# Altium schematic sheet [02] - MCU.SchDoc
size A2; DocumentNumber: 2; SheetNumber: 2; SheetTotal: 14
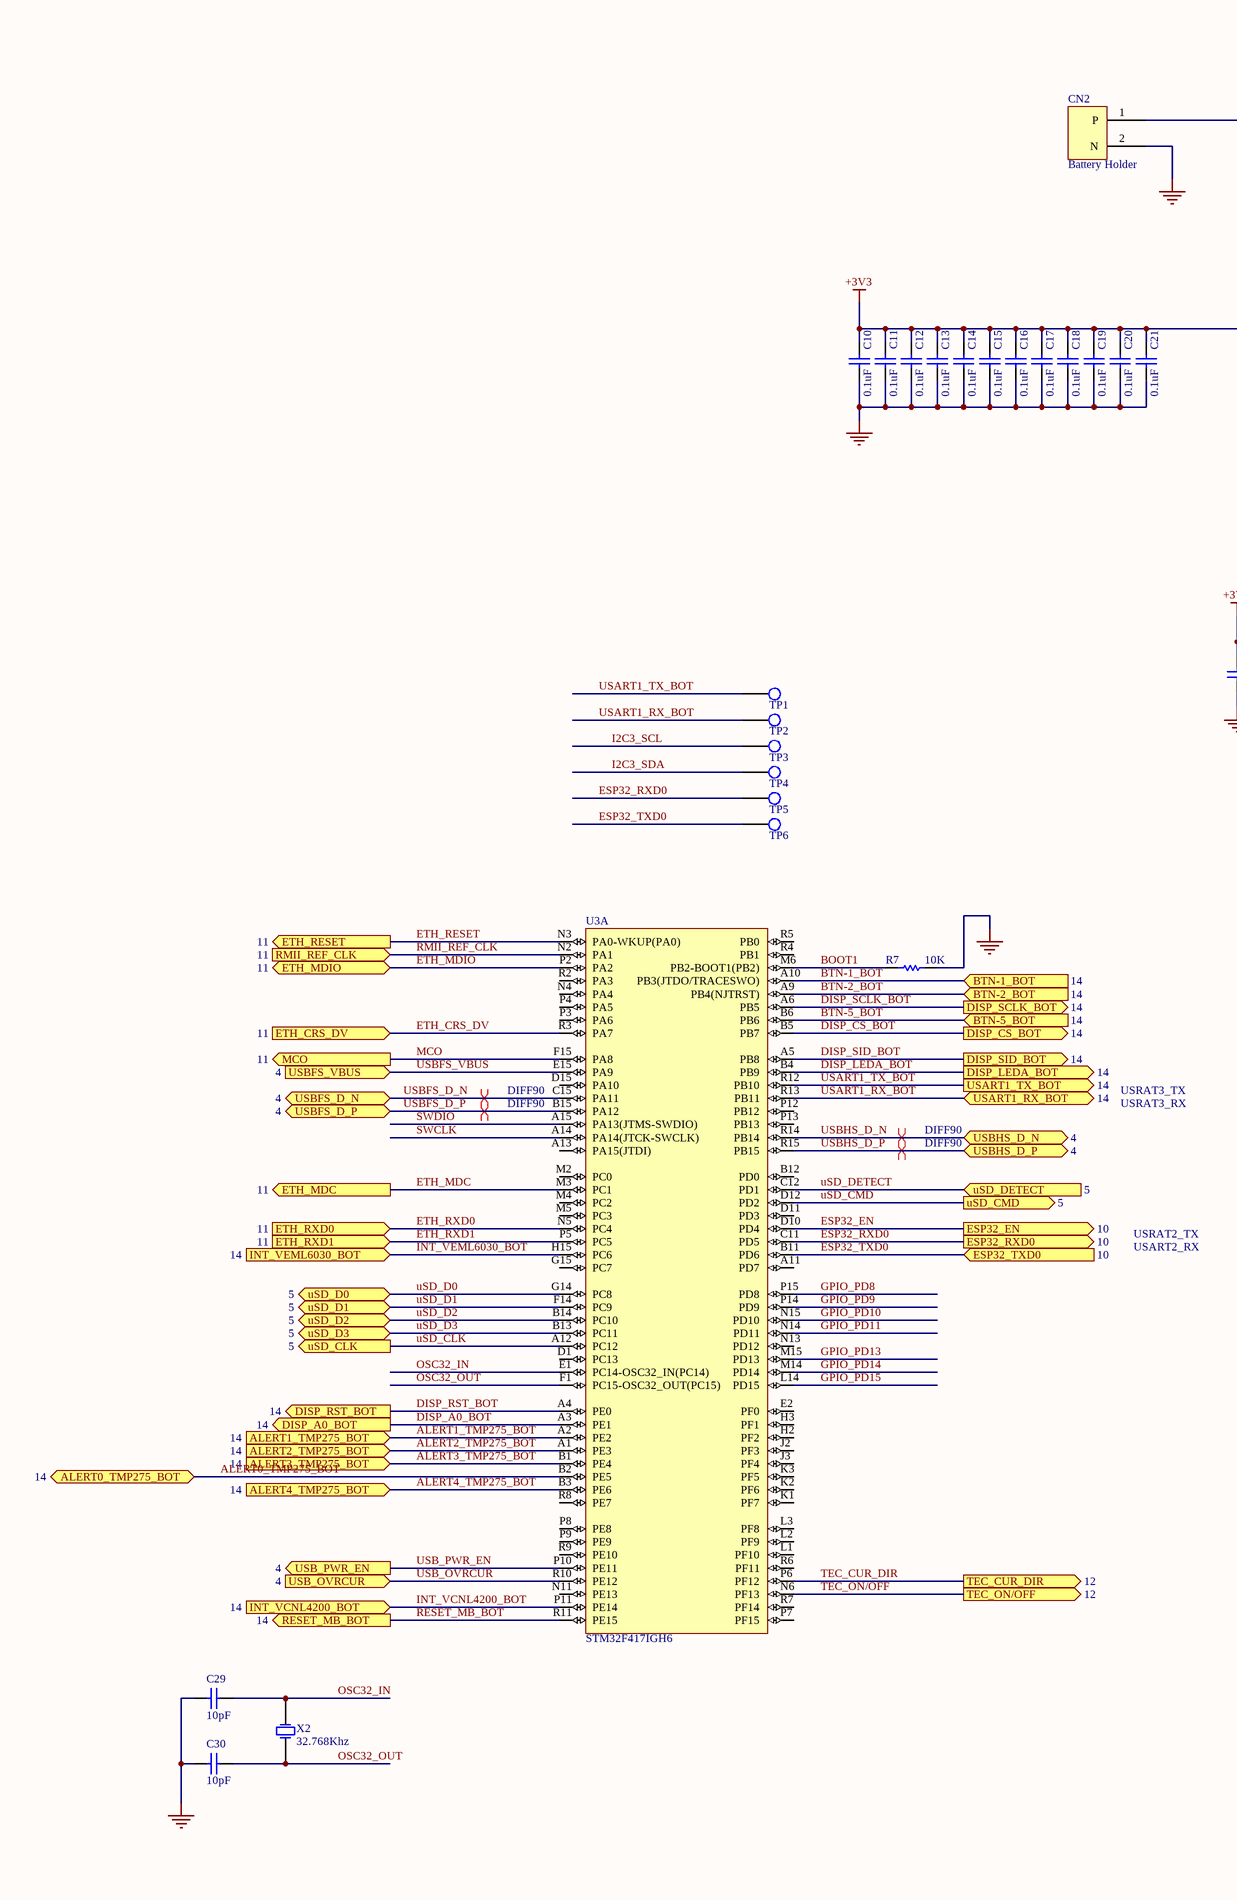
[diagram p0: [02] - MCU.SchDoc, left]
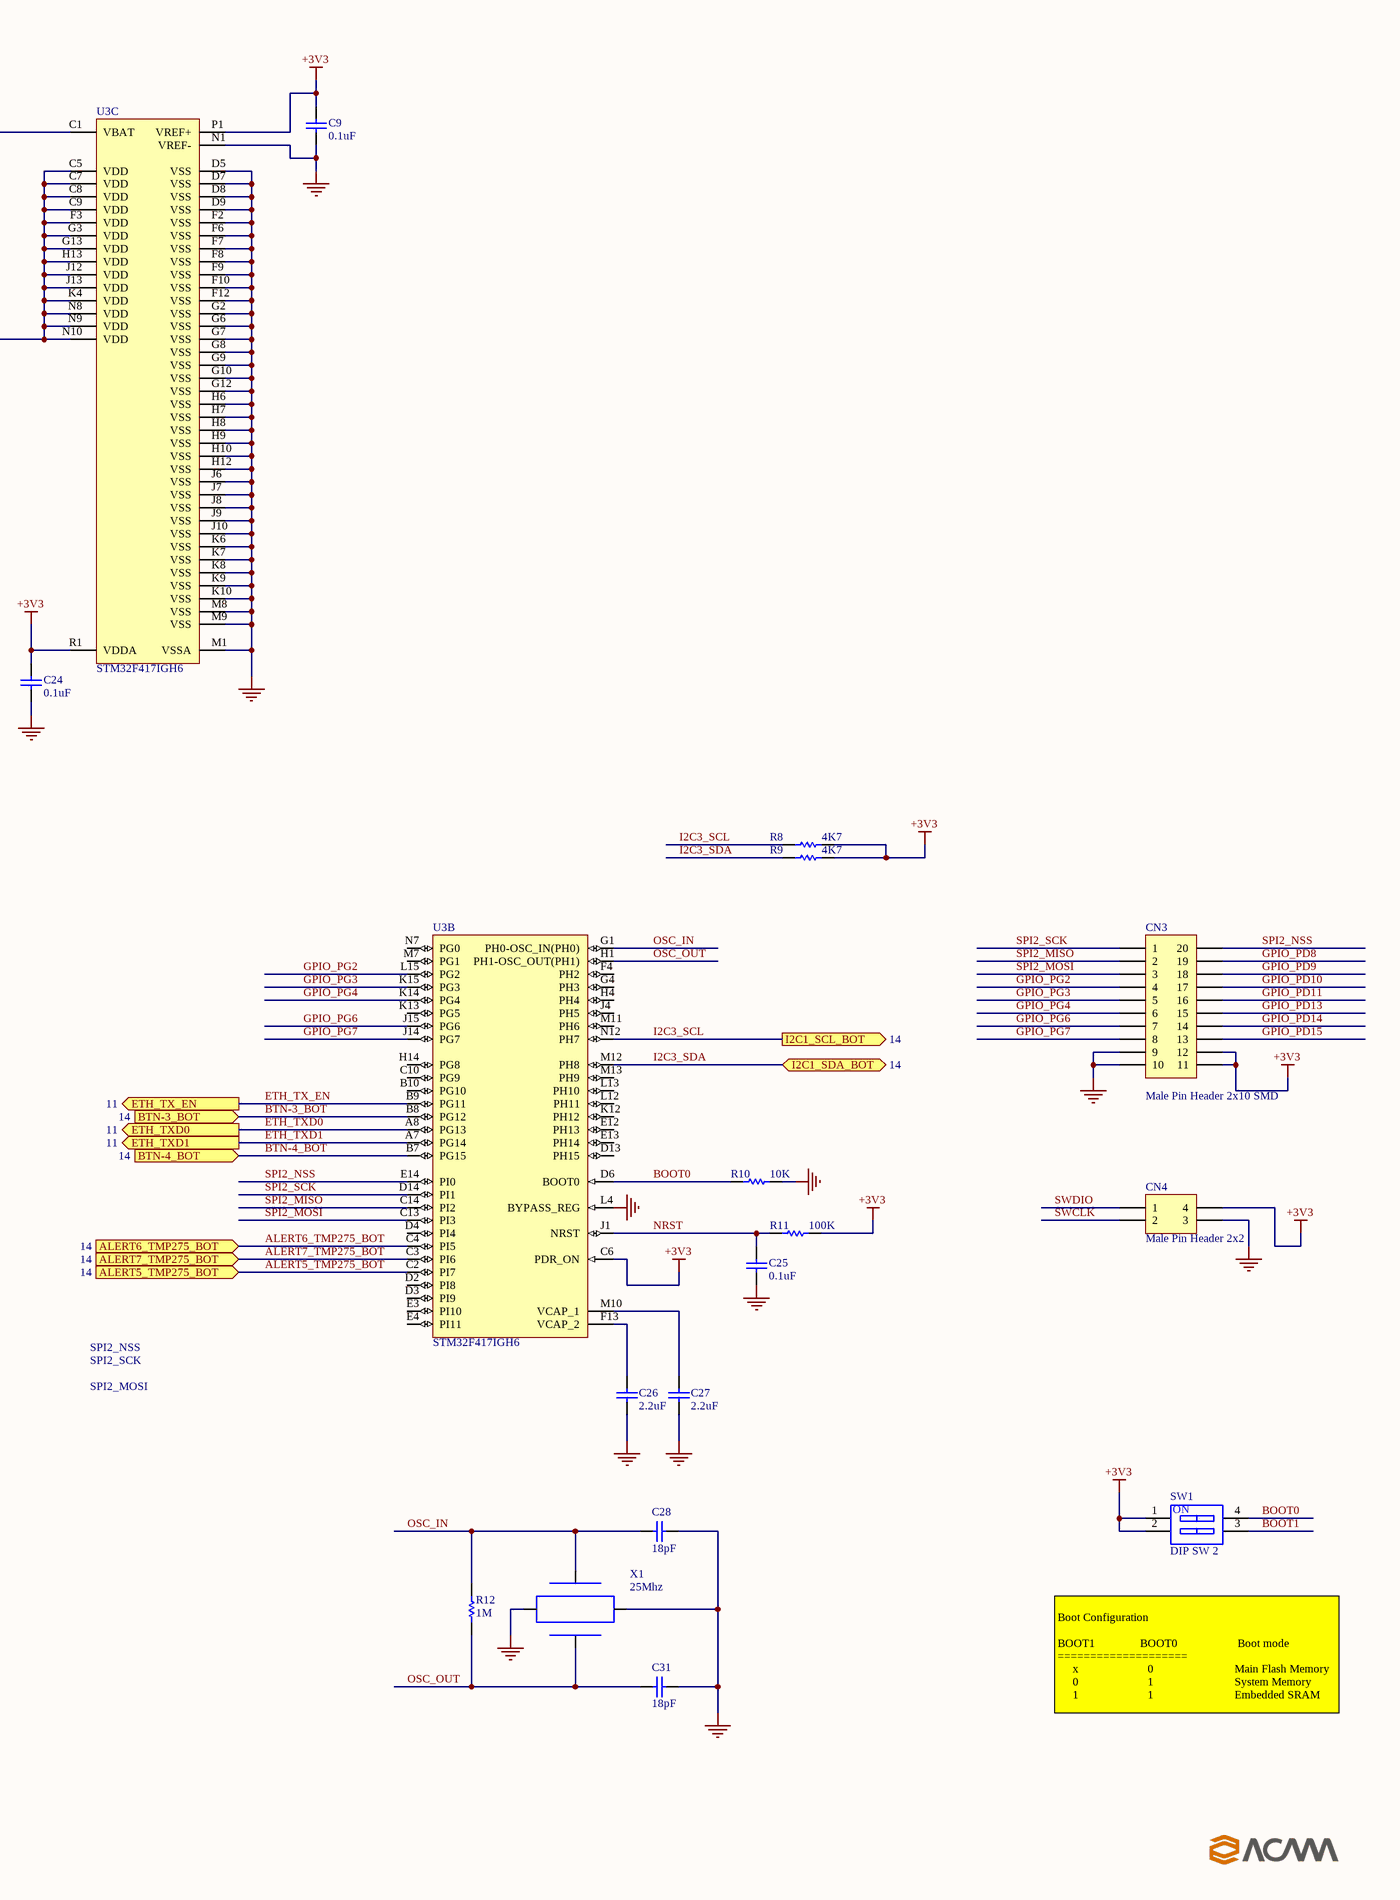
[diagram p1: [02] - MCU.SchDoc, right]

## Parts
C9  0.1uF  [0402_C_AUTO]
C10  0.1uF  [0402_C_AUTO]
C11  0.1uF  [0402_C_AUTO]
C12  0.1uF  [0402_C_AUTO]
C13  0.1uF  [0402_C_AUTO]
C14  0.1uF  [0402_C_AUTO]
C15  0.1uF  [0402_C_AUTO]
C16  0.1uF  [0402_C_AUTO]
C17  0.1uF  [0402_C_AUTO]
C18  0.1uF  [0402_C_AUTO]
C19  0.1uF  [0402_C_AUTO]
C20  0.1uF  [0402_C_AUTO]
C21  0.1uF  [0402_C_AUTO]
C24  0.1uF  [0402_C_AUTO]
C25  0.1uF  [0402_C_AUTO]
C26  2.2uF  [0402_C_AUTO]
C27  2.2uF  [0402_C_AUTO]
C28  18pF  [0402_C_AUTO]
C29  10pF  [0402_C_AUTO]
C30  10pF  [0402_C_AUTO]
C31  18pF  [0402_C_AUTO]
CN2  Battery Holder  [CR2032_BATT_HOLDER]
CN3  Male Pin Header 2x10 SMD  [HEADER_SMD_2x10]
CN4  Male Pin Header 2x2  [Header_2x2_RIGHT]
R7  10K  [0402_R_AUTO]
R8  4K7  [0402_R]
R9  4K7  [0402_R]
R10  10K  [0402_R_AUTO]
R11  100K  [0402_R_AUTO]
R12  1M  [0402_R]
SW1  DIP SW 2  [DIP-SW-2-Piano]
TP1  Test Point  [PIN_1.5mm]  (value not drawn)
TP2  Test Point  [PIN_1.5mm]  (value not drawn)
TP3  Test Point  [PIN_1.5mm]  (value not drawn)
TP4  Test Point  [PIN_1.5mm]  (value not drawn)
TP5  Test Point  [PIN_1mm]  (value not drawn)
TP6  Test Point  [PIN_1mm]  (value not drawn)
U3  STM32F417IGH6  [STM-UFBGA176+25]  (parts A,B,C of 3)
X1  25Mhz  [OSC_3.2x2.5]
X2  32.768Khz  [XTAL_2.0x1.2]

## Ports
ALERT0_TMP275_BOT (bidir, see 14), ALERT1_TMP275_BOT (in, see 14), ALERT2_TMP275_BOT (in, see 14), ALERT3_TMP275_BOT (in, see 14), ALERT4_TMP275_BOT (in, see 14), ALERT5_TMP275_BOT (in, see 14), ALERT6_TMP275_BOT (in, see 14), ALERT7_TMP275_BOT (in, see 14), BTN-1_BOT (in, see 14), BTN-2_BOT (in, see 14), BTN-3_BOT (in, see 14), BTN-4_BOT (in, see 14), BTN-5_BOT (in, see 14), DISP_A0_BOT (out, see 14), DISP_CS_BOT (out, see 14), DISP_LEDA_BOT (out, see 14), DISP_RST_BOT (out, see 14), DISP_SCLK_BOT (out, see 14), DISP_SID_BOT (out, see 14), ESP32_EN (out, see 10), ESP32_RXD0 (out, see 10), ESP32_TXD0 (in, see 10), ETH_CRS_DV (in, see 11), ETH_MDC (out, see 11), ETH_MDIO (bidir, see 11), ETH_RESET (out, see 11), ETH_RXD0 (in, see 11), ETH_RXD1 (in, see 11), ETH_TX_EN (out, see 11), ETH_TXD0 (out, see 11), ETH_TXD1 (out, see 11), I2C1_SCL_BOT (out, see 14), I2C1_SDA_BOT (bidir, see 14), INT_VCNL4200_BOT (in, see 14), INT_VEML6030_BOT (in, see 14), MCO (out, see 11), RESET_MB_BOT (out, see 14), RMII_REF_CLK (in, see 11), TEC_CUR_DIR (out, see 12), TEC_ON/OFF (out, see 12), USART1_RX_BOT (bidir, see 14), USART1_TX_BOT (out, see 14), USB_OVRCUR (in, see 4), USB_PWR_EN (out, see 4), USBFS_D_N (bidir, see 4), USBFS_D_P (bidir, see 4), USBFS_VBUS (in, see 4), USBHS_D_N (bidir, see 4), USBHS_D_P (bidir, see 4), uSD_CLK (out, see 5), uSD_CMD (out, see 5), uSD_D0 (bidir, see 5), uSD_D1 (bidir, see 5), uSD_D2 (bidir, see 5), uSD_D3 (bidir, see 5), uSD_DETECT (in, see 5)

## Nets
+3V3: C9.2 C10.2 C11.2 C12.2 C13.2 C14.2 C15.2 C16.2 C17.2 C18.2 C19.2 C20.2 C21.2 C24.2 CN3.11 CN3.12 CN4.4 R8.1 R9.1 R11.2 SW1.1(A1) SW1.2(A2) U3.C5(VDD) U3.C6(PDR_ON) U3.C7(VDD) U3.C8(VDD) U3.C9(VDD) U3.F3(VDD) U3.G3(VDD) U3.G13(VDD) U3.H13(VDD) U3.J12(VDD) U3.J13(VDD) U3.K4(VDD) U3.N8(VDD) U3.N9(VDD) U3.N10(VDD) U3.P1(VREF+) U3.R1(VDDA)
GND: C9.1 C10.1 C11.1 C12.1 C13.1 C14.1 C15.1 C16.1 C17.1 C18.1 C19.1 C20.1 C21.1 C24.1 C25.1 C26.1 C27.1 C28.2 C29.1 C30.1 C31.2 CN2.2(N) CN3.9 CN3.10 CN4.3 R7.2 R10.2 U3.D5(VSS) U3.D7(VSS) U3.D8(VSS) U3.D9(VSS) U3.F2(VSS) U3.F6(VSS) U3.F7(VSS) U3.F8(VSS) U3.F9(VSS) U3.F10(VSS) U3.F12(VSS) U3.G2(VSS) U3.G6(VSS) U3.G7(VSS) U3.G8(VSS) U3.G9(VSS) U3.G10(VSS) U3.G12(VSS) U3.H6(VSS) U3.H7(VSS) U3.H8(VSS) U3.H9(VSS) U3.H10(VSS) U3.H12(VSS) U3.J6(VSS) U3.J7(VSS) U3.J8(VSS) U3.J9(VSS) U3.J10(VSS) U3.K6(VSS) U3.K7(VSS) U3.K8(VSS) U3.K9(VSS) U3.K10(VSS) U3.L4(BYPASS_REG) U3.M1(VSSA) U3.M8(VSS) U3.M9(VSS) U3.N1(VREF-) X1.2(GND1) X1.4(GND2)
ALERT0_TMP275_BOT: U3.B2(PE5) ; port ALERT0_TMP275_BOT
ALERT1_TMP275_BOT: U3.A2(PE2) ; port ALERT1_TMP275_BOT
ALERT2_TMP275_BOT: U3.A1(PE3) ; port ALERT2_TMP275_BOT
ALERT3_TMP275_BOT: U3.B1(PE4) ; port ALERT3_TMP275_BOT
ALERT4_TMP275_BOT: U3.B3(PE6) ; port ALERT4_TMP275_BOT
ALERT5_TMP275_BOT: U3.C2(PI7) ; port ALERT5_TMP275_BOT
ALERT6_TMP275_BOT: U3.C4(PI5) ; port ALERT6_TMP275_BOT
ALERT7_TMP275_BOT: U3.C3(PI6) ; port ALERT7_TMP275_BOT
BOOT0: R10.1 SW1.4(A4) U3.D6(BOOT0)
BOOT1: R7.1 SW1.3(A3) U3.M6(PB2-BOOT1(PB2))
BTN-1_BOT: U3.A10(PB3(JTDO/TRACESWO)) ; port BTN-1_BOT
BTN-2_BOT: U3.A9(PB4(NJTRST)) ; port BTN-2_BOT
BTN-3_BOT: U3.B8(PG12) ; port BTN-3_BOT
BTN-4_BOT: U3.B7(PG15) ; port BTN-4_BOT
BTN-5_BOT: U3.B6(PB6) ; port BTN-5_BOT
DISP_A0_BOT: U3.A3(PE1) ; port DISP_A0_BOT
DISP_CS_BOT: U3.B5(PB7) ; port DISP_CS_BOT
DISP_LEDA_BOT: U3.B4(PB9) ; port DISP_LEDA_BOT
DISP_RST_BOT: U3.A4(PE0) ; port DISP_RST_BOT
DISP_SCLK_BOT: U3.A6(PB5) ; port DISP_SCLK_BOT
DISP_SID_BOT: U3.A5(PB8) ; port DISP_SID_BOT
ESP32_EN: U3.D10(PD4) ; port ESP32_EN
ESP32_RXD0: TP5.1 U3.C11(PD5) ; port ESP32_RXD0
ESP32_TXD0: TP6.1 U3.B11(PD6) ; port ESP32_TXD0
ETH_CRS_DV: U3.R3(PA7) ; port ETH_CRS_DV
ETH_MDC: U3.M3(PC1) ; port ETH_MDC
ETH_MDIO: U3.P2(PA2) ; port ETH_MDIO
ETH_RESET: U3.N3(PA0-WKUP(PA0)) ; port ETH_RESET
ETH_RXD0: U3.N5(PC4) ; port ETH_RXD0
ETH_RXD1: U3.P5(PC5) ; port ETH_RXD1
ETH_TX_EN: U3.B9(PG11) ; port ETH_TX_EN
ETH_TXD0: U3.A8(PG13) ; port ETH_TXD0
ETH_TXD1: U3.A7(PG14) ; port ETH_TXD1
GPIO_PD8: CN3.19 U3.P15(PD8)
GPIO_PD9: CN3.18 U3.P14(PD9)
GPIO_PD10: CN3.17 U3.N15(PD10)
GPIO_PD11: CN3.16 U3.N14(PD11)
GPIO_PD13: CN3.15 U3.M15(PD13)
GPIO_PD14: CN3.14 U3.M14(PD14)
GPIO_PD15: CN3.13 U3.L14(PD15)
GPIO_PG2: CN3.4 U3.L15(PG2)
GPIO_PG3: CN3.5 U3.K15(PG3)
GPIO_PG4: CN3.6 U3.K14(PG4)
GPIO_PG6: CN3.7 U3.J15(PG6)
GPIO_PG7: CN3.8 U3.J14(PG7)
I2C3_SCL: R8.2 TP3.1 U3.N12(PH7) ; port I2C1_SCL_BOT
I2C3_SDA: R9.2 TP4.1 U3.M12(PH8) ; port I2C1_SDA_BOT
INT_VCNL4200_BOT: U3.P11(PE14) ; port INT_VCNL4200_BOT
INT_VEML6030_BOT: U3.H15(PC6) ; port INT_VEML6030_BOT
MCO: U3.F15(PA8) ; port MCO
NRST: C25.2 R11.1 U3.J1(NRST)
OSC32_IN: C29.2 U3.E1(PC14-OSC32_IN(PC14)) X2.1(OSC1)
OSC32_OUT: C30.2 U3.F1(PC15-OSC32_OUT(PC15)) X2.2(OSC2)
OSC_IN: C28.1 R12.2 U3.G1(PH0-OSC_IN(PH0)) X1.1
OSC_OUT: C31.1 R12.1 U3.H1(PH1-OSC_OUT(PH1)) X1.3
RESET_MB_BOT: U3.R11(PE15) ; port RESET_MB_BOT
RMII_REF_CLK: U3.N2(PA1) ; port RMII_REF_CLK
SPI2_MISO: CN3.2 U3.C14(PI2)
SPI2_MOSI: CN3.3 U3.C13(PI3)
SPI2_NSS: CN3.20 U3.E14(PI0)
SPI2_SCK: CN3.1 U3.D14(PI1)
SWCLK: CN4.2 U3.A14(PA14(JTCK-SWCLK))
SWDIO: CN4.1 U3.A15(PA13(JTMS-SWDIO))
TEC_CUR_DIR: U3.P6(PF12) ; port TEC_CUR_DIR
TEC_ON/OFF: U3.N6(PF13) ; port TEC_ON/OFF
USART1_RX_BOT: TP2.1 U3.R13(PB11) ; port USART1_RX_BOT
USART1_TX_BOT: TP1.1 U3.R12(PB10) ; port USART1_TX_BOT
USB_OVRCUR: U3.R10(PE12) ; port USB_OVRCUR
USB_PWR_EN: U3.P10(PE11) ; port USB_PWR_EN
USBFS_D_N: U3.C15(PA11) ; port USBFS_D_N
USBFS_D_P: U3.B15(PA12) ; port USBFS_D_P
USBFS_VBUS: U3.E15(PA9) ; port USBFS_VBUS
USBHS_D_N: U3.R14(PB14) ; port USBHS_D_N
USBHS_D_P: U3.R15(PB15) ; port USBHS_D_P
uSD_CLK: U3.A12(PC12) ; port uSD_CLK
uSD_CMD: U3.D12(PD2) ; port uSD_CMD
uSD_D0: U3.G14(PC8) ; port uSD_D0
uSD_D1: U3.F14(PC9) ; port uSD_D1
uSD_D2: U3.B14(PC10) ; port uSD_D2
uSD_D3: U3.B13(PC11) ; port uSD_D3
uSD_DETECT: U3.C12(PD1) ; port uSD_DETECT
NetC26_2: C26.2 U3.F13(VCAP_2)
NetC27_2: C27.2 U3.M10(VCAP_1)
NetCN2_1: CN2.1(P) U3.C1(VBAT)

Not connected (* = marked no-connect by the designer): U3 A11(PD7) A13(PA15(JTDI)) B10(PG10) B12(PD0) C10(PG9) D1(PC13) D2(PI8) D3(PI9) D4(PI4) D11(PD3) D13(PH15) D15(PA10) E2(PF0) E3(PI10) E4(PI11) E12(PH13) E13(PH14) F4(PH2) G4(PH3) G15(PC7) H2(PF2) H3(PF1) H4(PH4) H14(PG8) J2(PF3) J3(PF4) J4(PH5) K1(PF7) K2(PF6) K3(PF5) K12(PH12) K13(PG5) L1(PF10) L2(PF9) L3(PF8) L12(PH11) L13(PH10) M2(PC0) M4(PC2) M5(PC3) M7(PG1) M11(PH6) M13(PH9) N4(PA4) N7(PG0) N11(PE13) N13(PD12) P3(PA6) P4(PA5) P7(PF15) P8(PE8) P9(PE9) P12(PB12) P13(PB13) R2(PA3) R4(PB1) R5(PB0) R6(PF11) R7(PF14) R8(PE7) R9(PE10)

## Layout directives
differential pair; differential pair class DIFF90: USBFS_D_N, USBFS_D_P, USBHS_D_N, USBHS_D_P

## Notes on the sheet
- USRAT3_TX
- USRAT3_RX
- USRAT2_TX
- USART2_RX
- SPI2_NSS
- SPI2_SCK
- SPI2_MOSI
- Boot Configuration
  BOOT1               BOOT0                    Boot mode
  ====================
  x                       0                           Main Flash Memory
  0                       1                           System Memory
  1                       1                           Embedded SRAM
- (in symbol DIP SW-2) ON

## Library data of the parts
C9-C21 C24-C31 = Cap SMD: Non-Pol SMD Capacitor; RATED_VOLTAGE: 16V; Manufacturer Part Num: *
  C9-C21 C24 C25: Value: 0.1uF
  C26 C27: Value: 2.2uF
  C28 C31: Value: 18pF
  C29 C30: Value: 10pF
CN2 = Battery Holder: CR2032 Battery Holder SMD; Value: Battery Holder; Manufacturer Part Num: *
CN3 = Pin header Male 2x10 smd: SMD Male Pin Header 2.54mm Pitch, 2x10; Value: Male Pin Header 2x10 SMD
CN4 = Pin header Male 2x2: Male Pin Header 2.54mm Pitch, 2x2; Value: Male Pin Header 2x2
R7-R12 = Res SMD: SMD Resistor; Tolerance: 5%; Manufacturer Part Num: *
  R7 R10: Value: 10K
  R8 R9: Value: 4K7
  R11: Value: 100K
  R12: Value: 1M
SW1 = DIP SW-2: DIP Switch, 2 Position, SPST; Manufacturer Part Num: BPA02B; Value: DIP SW 2
TP1-TP6 = Test Point: Test Point Footprint; Value: Test Point
U3 = STM32F417IGH6: ARM Cortex-M4 32-bit MCU+FPU, 210 DMIPS, 1024 kB Flash, 192 kB Internal RAM, 140 I/Os, 176-pin BGA, -40 to 85 degC, Tray; Manufacturer: STMicroelectronics; D/A Converter: 2x12-bit; FLASH Size (Prog) (kB): 1024; I/Os (High Current): 140; Internal RAM Size (kB): 192; Operating Frequency(F) (Processor speed) (MHz): 168; Supply Voltage(Vcc) max (V): 3.6; Supply Voltage(Vcc) min (V): 1.8; DatasheetVersion: Rev. 4; PackageVersion: Rev. 4, 06/2013; PackageReference: UFBGA176+25; PackageDescription: 176+25-Ball Ultra Thin Fine Pitch Ball Grid Array, 10 x 10 x 0.6 mm Body, 0.65 mm Pitch; Supplier 1: Digi-Key; Supplier Part Number 1: 497-11913-ND; Supplier 2: Farnell; Supplier Part Number 2: 2064371; Supplier 3: Newark; Supplier Part Number 3: 73T2336; Supplier 4: Mouser; Supplier Part Number 4: 511-STM32F417IGH6; Core: ARM Cortex-M4; Packing: Tray; Mounting Technology: Surface Mount; PartNumber: STM32F417IGH6; ComponentLink1Description: Manufacturer URL; ComponentLink1URL: http://www.st.com/web/en/home.html; ComponentLink2Description: Datasheet; ComponentLink2URL: http://www.st.com/st-web-ui/static/active/en/resource/technical/document/datasheet/DM00035129.pdf; ComponentLink3Description: Package Specification; ComponentLink3URL: http://www.st.com/st-web-ui/static/active/en/resource/technical/document/datasheet/DM00037051.pdf
X1 = XTAL 4pin: 4-pin SMD Crystal; Manufacturer Part Num: ECS-250-18-33-JTN-TR; Value: 25Mhz
X2 = XTAL: 2-pin SMD Crystal; Manufacturer Part Num: ECS-.327-12.5-12R-TR; Value: 32.768Khz